# EAGLE design 6pin_bus (EAGLE 7.5.0)
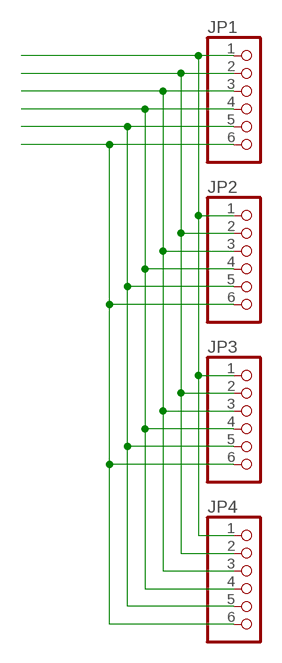
[diagram p0: schematic, sheet 1]

## Parts
JP1  PINHD-1X6  [1X06]
JP2  PINHD-1X6  [1X06]
JP3  PINHD-1X6  [1X06]
JP4  PINHD-1X6  [1X06]

## Nets
N$1: JP1.1 JP2.1 JP3.1 JP4.1
N$2: JP1.2 JP2.2 JP3.2 JP4.2
N$3: JP1.3 JP2.3 JP3.3 JP4.3
N$4: JP1.4 JP2.4 JP3.4 JP4.4
N$5: JP1.5 JP2.5 JP3.5 JP4.5
N$7: JP1.6 JP2.6 JP3.6 JP4.6

## Library data of the parts
JP1-JP4 = pinhead:PINHD-1X6: PIN HEADER

## Board
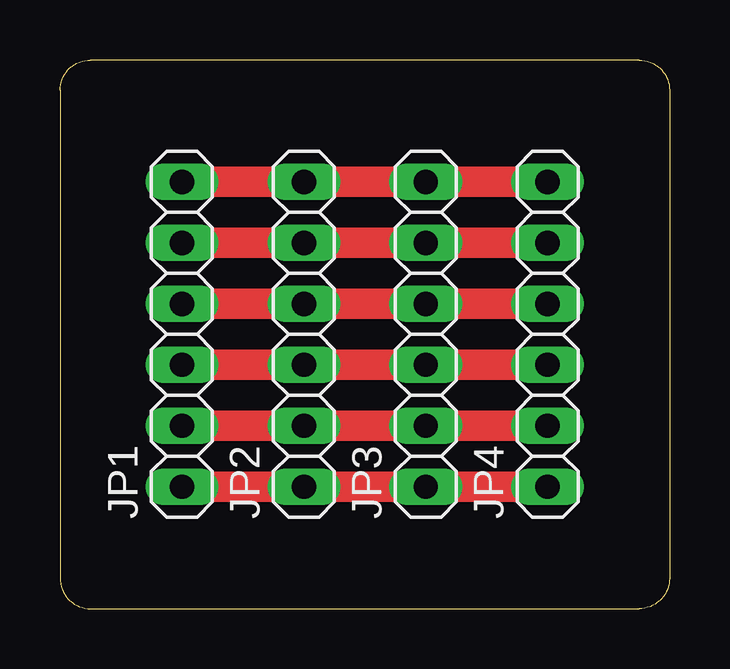
[diagram p1: board, top side]

Size 25.4 x 22.86 mm. Coordinates in mm from the lower left corner, seen from the top.
Outline: 1.27,0 24.13,0 arc90 25.4,1.27 25.4,21.59 arc90 24.13,22.86 1.27,22.86 arc90 0,21.59 0,1.27 arc90 1.27,0
Copper layers (1*16): Top 0.035mm / dielectric 1.5mm / Bottom 0.035mm
Design rules "default": minimum track width 10mil, minimum drill 24mil, track to track 8mil, track to pad 8mil, pad to pad 8mil, via to via 8mil, smd to smd 8mil, copper to edge 40mil, drill to drill 8mil, minimum pad ring 10mil, minimum via ring 8mil, stop-mask expansion 4mil, vias tented up to drill 0mil, thermal gap 10mil

### Footprints (pad centres in the part's own frame; a part is rotated, then mirrored left to right if it is on the bottom)
1X06 = drill 1.016 long: 1 -6.35,0; 2 -3.81,0; 3 -1.27,0; 4 1.27,0; 5 3.81,0; 6 6.35,0

### Placement (x,y rotation side)
JP1  5.08,11.43 90 top
JP2  10.16,11.43 90 top
JP3  15.24,11.43 90 top
JP4  20.32,11.43 90 top

### Tracks (layer width: path | path; a pad name or v marks a point on that pad's centre or on a via)
N$1
  Top 1.27: JP1.1 JP2.1 JP3.1 JP4.1
N$2
  Top 1.27: JP1.2 JP2.2 JP3.2 JP4.2
N$3
  Top 1.27: JP1.3 JP2.3 JP3.3 JP4.3
N$4
  Top 1.27: JP1.4 JP2.4 JP3.4 JP4.4
N$5
  Top 1.27: JP1.5 JP2.5 JP3.5 JP4.5
N$7
  Top 1.27: JP1.6 JP2.6 JP3.6 JP4.6